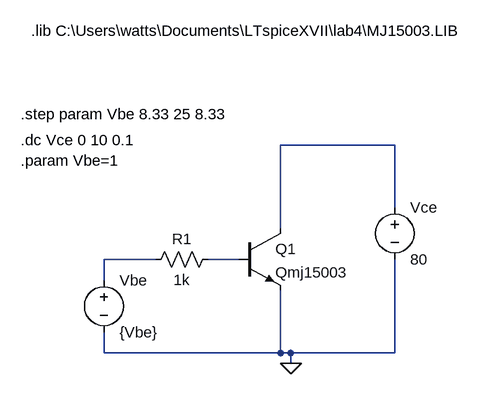
[diagram p0: schematic npn_mj15003.asc]
npn_mj15003.asc, the LTspice schematic file:
Version 4
SHEET 1 880 680
WIRE 384 -16 208 -16
WIRE 384 80 384 -16
WIRE 208 112 208 -16
WIRE 16 160 -64 160
WIRE 144 160 96 160
WIRE -64 192 -64 160
WIRE -64 304 -64 272
WIRE 208 304 208 208
WIRE 208 304 -64 304
WIRE 224 304 208 304
WIRE 384 304 384 160
WIRE 384 304 224 304
WIRE 224 320 224 304
FLAG 224 320 0
SYMBOL voltage 384 64 R0
SYMATTR InstName Vce
SYMATTR Value 80
SYMBOL res 112 144 R90
WINDOW 0 0 56 VBottom 2
WINDOW 3 32 56 VTop 2
SYMATTR InstName R1
SYMATTR Value 1k
SYMBOL voltage -64 176 R0
SYMATTR InstName Vbe
SYMATTR Value {Vbe}
SYMBOL npn 144 112 R0
SYMATTR InstName Q1
SYMATTR Value Qmj15003
TEXT -192 -64 Left 2 !.step param Vbe 8.33 25 8.33
TEXT -192 -24 Left 2 !.dc Vce 0 10 0.1
TEXT -192 8 Left 2 !.param Vbe=1
TEXT -176 -192 Left 2 !.lib C:\\Users\\watts\\Documents\\LTspiceXVII\\lab4\\MJ15003.LIB

The netlist it stands for:
* npn_mj15003.asc
Vce N001 0 80
R1 N003 N002 1k
Vbe N002 0 {Vbe}
Q1 N001 N003 0 0 Qmj15003
.model NPN NPN
.model PNP PNP
.lib standard.bjt
.step param Vbe 8.33 25 8.33
.dc Vce 0 10 0.1
.param Vbe=1
.lib C:\Users\watts\Documents\LTspiceXVII\lab4\MJ15003.LIB
.backanno
.end